# EAGLE schematic RelTerHig (EAGLE 6.3)
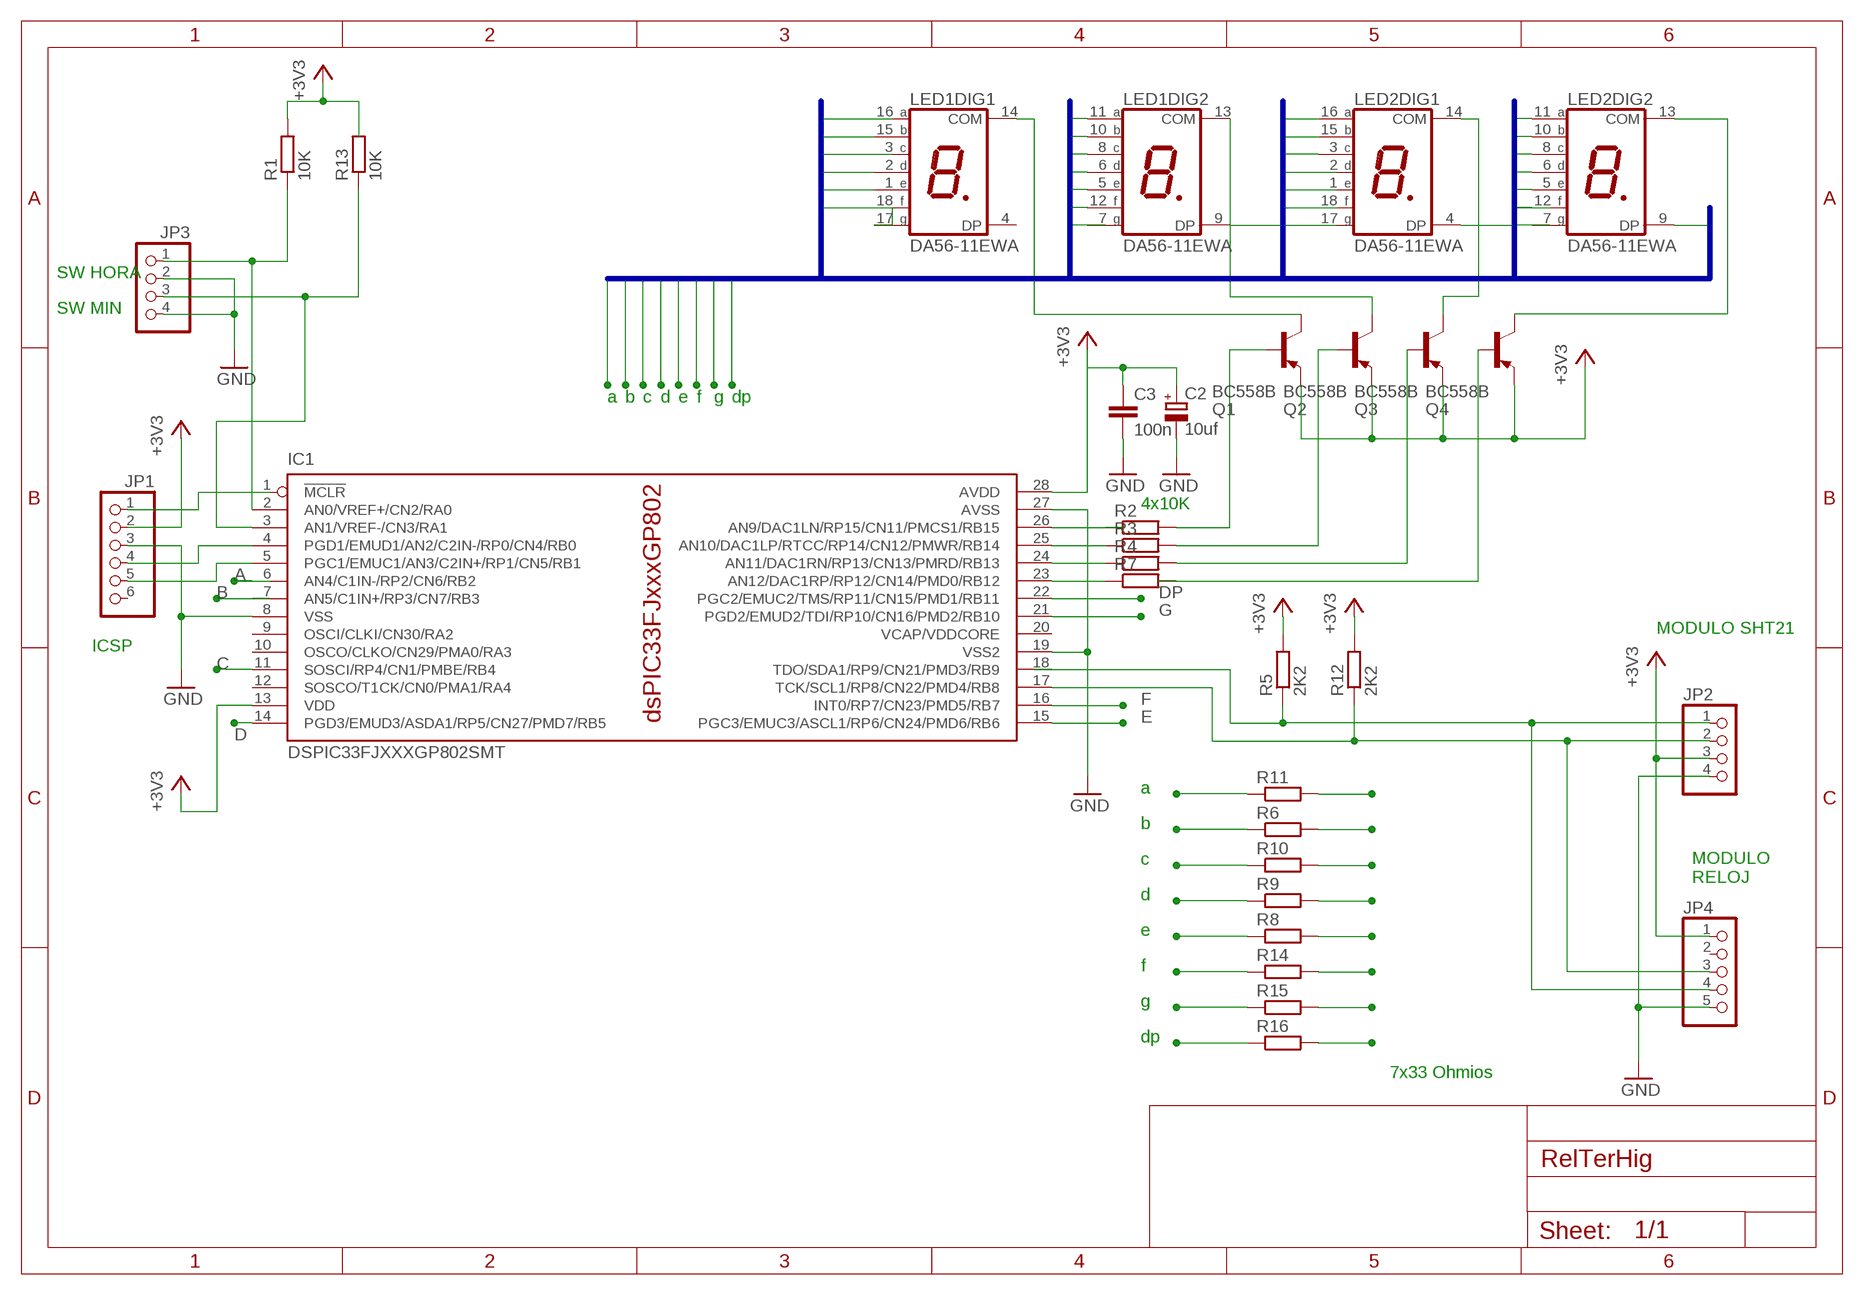
[diagram p0: schematic, sheet 1]

## Parts
C2  10uf  CPOL-EUB/3528-21R  [B/3528-21R]
C3  100n  C-EU025-024X044  [C025-024X044]
IC1  DSPIC33FJXXXGP802SMT  [SO28W]
JP1  PINHD-1X6  [1X06]
JP2  PINHD-1X4  [1X04]
JP3  PINHD-1X4  [1X04]
JP4  PINHD-1X5  [1X05]
LED1  DA56-11EWA  [DA56]
LED2  DA56-11EWA  [DA56]
Q1  BC558B  [TO92-EBC]
Q2  BC558B  [TO92-EBC]
Q3  BC558B  [TO92-EBC]
Q4  BC558B  [TO92-EBC]
R1  10K  R-EU_0204/5  [0204/5]
R2  R-EU_0204/5  [0204/5]
R3  R-EU_0204/5  [0204/5]
R4  R-EU_0204/5  [0204/5]
R5  2K2  R-EU_0204/5  [0204/5]
R6  R-EU_0204/5  [0204/5]
R7  R-EU_0204/5  [0204/5]
R8  R-EU_0204/5  [0204/5]
R9  R-EU_0204/5  [0204/5]
R10  R-EU_0204/5  [0204/5]
R11  R-EU_0204/5  [0204/5]
R12  2K2  R-EU_0204/5  [0204/5]
R13  10K  R-EU_0204/5  [0204/5]
R14  R-EU_0204/5  [0204/5]
R15  R-EU_0204/5  [0204/5]
R16  R-EU_0204/5  [0204/5]

## Nets
+3V3: C2.+ C3.1 IC1.13(VDD) IC1.28(AVDD) JP1.2 JP2.3 JP4.1 Q1.E Q2.E Q3.E Q4.E R1.2 R5.2 R12.2 R13.2
A: IC1.6(AN4/C1IN-/RP2/CN6/RB2)
B$1: LED1.1(DIG1:E) LED1.2(DIG1:D) LED1.5(DIG2:E) LED1.6(DIG2:D) LED1.8(DIG2:C) LED1.9(DIG2:DP) LED1.10(DIG2:B) LED1.11(DIG2:A) LED1.12(DIG2:F) LED1.15(DIG1:B) LED1.17(DIG1:G) LED2.4(DIG1:DP) LED2.5(DIG2:E) LED2.6(DIG2:D) LED2.8(DIG2:C) LED2.9(DIG2:DP) LED2.10(DIG2:B) LED2.11(DIG2:A) LED2.12(DIG2:F) LED2.15(DIG1:B) LED2.16(DIG1:A)
C: IC1.11(SOSCI/RP4/CN1/PMBE/RB4)
D: IC1.14(PGD3/EMUD3/ASDA1/RP5/CN27/PMD7/RB5)
DP: IC1.22(PGC2/EMUC2/TMS/RP11/CN15/PMD1/RB11)
E: IC1.15(PGC3/EMUC3/ASCL1/RP6/CN24/PMD6/RB6)
F: IC1.16(INT0/RP7/CN23/PMD5/RB7)
G: IC1.21(PGD2/EMUD2/TDI/RP10/CN16/PMD2/RB10)
GND: C2.- C3.2 IC1.8(VSS) IC1.19(VSS2) IC1.27(AVSS) JP1.3 JP2.4 JP3.2 JP3.4 JP4.5
N$1: IC1.26(AN9/DAC1LN/RP15/CN11/PMCS1/RB15)
N$2: IC1.25(AN10/DAC1LP/RTCC/RP14/CN12/PMWR/RB14) R3.1
N$3: IC1.24(AN11/DAC1RN/RP13/CN13/PMRD/RB13) R4.1
N$4: IC1.23(AN12/DAC1RP/RP12/CN14/PMD0/RB12) R7.1
N$5: Q1.B R2.2
N$6: Q2.B R3.2
N$7: Q3.B R4.2
N$8: Q4.B R7.2
N$9: IC1.1(!MCLR) JP1.1
N$10: LED1.14(DIG1:COM) Q1.C
N$11: IC1.4(PGD1/EMUD1/AN2/C2IN-/RP0/CN4/RB0) JP1.4
N$12: IC1.5(PGC1/EMUC1/AN3/C2IN+/RP1/CN5/RB1) JP1.5
N$13: IC1.2(AN0/VREF+/CN2/RA0) JP3.1 R1.1
N$14: IC1.3(AN1/VREF-/CN3/RA1) JP3.3 R13.1
N$15: JP2.1 JP4.4 R5.1
N$16: IC1.17(TCK/SCL1/RP8/CN22/PMD4/RB8) JP2.2 JP4.3 R12.1
N$17: LED1.13(DIG2:COM) Q2.C
N$18: LED2.14(DIG1:COM) Q3.C
N$19: R11.2
N$20: LED2.13(DIG2:COM) Q4.C
N$21: R6.2
N$22: R10.2
N$23: R9.2
N$24: R8.2
N$25: R14.2
N$26: R15.2
N$27: R11.1
N$28: R6.1
N$29: R10.1
N$30: R9.1
N$31: R8.1
N$32: R14.1
N$33: R15.1
N$34: R16.1
N$35: R16.2
Unconnected: IC1.7(AN5/C1IN+/RP3/CN7/RB3) IC1.9(OSCI/CLKI/CN30/RA2) IC1.10(OSCO/CLKO/CN29/PMA0/RA3) IC1.12(SOSCO/T1CK/CN0/PMA1/RA4) IC1.18(TDO/SDA1/RP9/CN21/PMD3/RB9) JP1.6 JP4.2 LED1.3(DIG1:C) LED1.4(DIG1:DP) LED1.7(DIG2:G) LED1.16(DIG1:A) LED1.18(DIG1:F) LED2.1(DIG1:E) LED2.2(DIG1:D) LED2.3(DIG1:C) LED2.7(DIG2:G) LED2.17(DIG1:G) LED2.18(DIG1:F) R2.1

## Buses
B$1

## Notes on the sheet
- SW HORA
- SW MIN
- a | b | c | d | e | f | g | dp
- 4x10K
- MODULO SHT21
- ICSP
- a
- b
- c
- MODULO
  RELOJ
- d
- e
- f
- g
- dp
- 7x33 Ohmios

## Power pins joined to a net without a drawn wire
VCAP/VDDCORE: IC1.20(VCAP/VDDCORE)

## Library data of the parts
C2 = rcl:CPOL-EU: POLARIZED CAPACITOR, European symbol
C3 = rcl:C-EU: CAPACITOR, European symbol
IC1 = microchip-dspic33:DSPIC33FJXXXGP802: High-Performance, 16-bit Digital Signal Controllers - dsPIC33FJ64GP802 & dsPIC33FJ128GP802 Source: http://ww1.microchip.com/downloads/en/DeviceDoc/70292B.pdf Operating Range: . Up to 40 MIPS operation (at 3.0-3.6V): - Industrial temperature range (-40°C to +85°C) - Extended temperature range (-40°C to +125°C) High-Performance DSC CPU: . Modified Harvard architecture . C compiler optimized instruction set . 16-bit wide data path . 24-bit wide instructions . Linear program memory addressing up to 4M instruction words . Linear data memory addressing up to 64 Kbytes . 83 base instructions: mostly 1 word/1 cycle . Two 40-bit accumulators with rounding and saturation options . Flexible and powerful addressing modes: - Indirect - Modulo - Bit-Reversed . Software stack . 16 x 16 fractional/integer multiply operations . 32/16 and 16/16 divide operations . Single-cycle multiply and accumulate: - Accumulator write back for DSP operations - Dual data fetch . Up to ±16-bit shifts for up to 40-bit data On-Chip Flash and SRAM: . Flash program memory . Data SRAM . Boot, Secure, and General Security for program Flash Direct Memory Access (DMA): . 8-channel hardware DMA . Up to 2 Kbytes dual ported DMA buffer area (DMA RAM) to store data transferred via DMA: - Allows data transfer between RAM and a peripheral while CPU is executing code (no cycle stealing) . Most peripherals support DMA Timers/Capture/Compare/PWM: . Timer/Counters, up to five 16-bit timers: - Can pair up to make two 32-bit timers - One timer runs as a Real-Time Clock with an external 32.768 kHz oscillator - Programmable prescaler . Input Capture (up to four channels): - Capture on up, down or both edges - 16-bit capture input functions - 4-deep FIFO on each capture . Output Compare (up to four channels): - Single or Dual 16-bit Compare mode - 16-bit Glitchless PWM mode . Hardware Real-Time Clock/Calendar (RTCC): - Provides clock, calendar, and alarm functions Interrupt Controller: . 5-cycle latency . 118 interrupt vectors . Up to 49 available interrupt sources . Up to three external interrupts . Seven programmable priority levels . Five processor exceptions Digital I/O: . Peripheral pin Select functionality . Up to 35 programmable digital I/O pins . Wake-up/Interrupt-on-Change for up to 21 pins . Output pins can drive from 3.0V to 3.6V . Up to 5V output with open drain configuration . All digital input pins are 5V tolerant . 4 mA sink on all I/O pins System Management: . Flexible clock options: - External, crystal, resonator, internal RC - Fully integrated Phase-Locked Loop (PLL) - Extremely low jitter PLL . Power-up Timer . Oscillator Start-up Timer/Stabilizer . Watchdog Timer with its own RC oscillator . Fail-Safe Clock Monitor . Reset by multiple sources Power Management: . On-chip 2.5V voltage regulator . Switch between clock sources in real time . Idle, Sleep, and Doze modes with fast wake-up Analog-to-Digital Converters (ADCs): . 10-bit, 1.1 Msps or 12-bit, 500 Ksps conversion: - Two and four simultaneous samples (10-bit ADC) - Up to 13 input channels with auto-scanning - Conversion start can be manual or synchronized with one of four trigger sources - Conversion possible in Sleep mode - ±2 LSb max integral nonlinearity - ±1 LSb max differential nonlinearity Audio Digital-to-Analog Converter (DAC): . 16-bit Dual Channel DAC module . 100 Ksps maximum sampling rate . Second-Order Digital Delta-Sigma Modulator Data Converter Interface (DCI) module: . Codec interface . Supports I2S and AC.97 protocols . Up to 16-bit data words, up to 16 words per frame . 4-word deep TX and RX buffers Comparator Module: . Two analog comparators with programmable input/output configuration CMOS Flash Technology: . Low-power, high-speed Flash technology . Fully static design . 3.3V (±10%) operating voltage . Industrial and Extended temperature . Low power consumption Communication Modules: . 4-wire SPI (up to two modules): - Framing supports I/O interface to simple codecs - Supports 8-bit and 16-bit data - Supports all serial clock formats and sampling modes . I2C?: - Full Multi-Master Slave mode support - 7-bit and 10-bit addressing - Bus collision detection and arbitration - Integrated signal conditioning - Slave address masking . UART (up to two modules): - Interrupt on address bit detect - Interrupt on UART error - Wake-up on Start bit from Sleep mode - 4-character TX and RX FIFO buffers - LIN bus support - IrDA® encoding and decoding in hardware - High-Speed Baud mode - Hardware Flow Control with CTS and RTS . Enhanced CAN (ECAN. module) 2.0B active: - Up to eight transmit and up to 32 receive buffers - 16 receive filters and three masks - Loopback, Listen Only and Listen All - Messages modes for diagnostics and bus monitoring - Wake-up on CAN message - Automatic processing of Remote Transmission Requests - FIFO mode using DMA - DeviceNet. addressing support . Parallel Master Slave Port (PMP/EPSP): - Supports 8-bit or 16-bit data - Supports 16 address lines . Programmable Cyclic Redundancy Check (CRC): - Programmable bit length for the CRC generator polynomial (up to 16-bit length) - 8-deep, 16-bit or 16-deep, 8-bit FIFO for data input
JP1 = pinhead:PINHD-1X6: PIN HEADER
JP2 JP3 = pinhead:PINHD-1X4: PIN HEADER
JP4 = pinhead:PINHD-1X5: PIN HEADER
LED1 LED2 = display-kingbright:DA56-11: 14.22mm (0.56INCH) DUAL DIGIT NUMERIC DISPLAYS Source: www.kingbright.com .. DA56-11SRWA.pdf; OC_FARNELL: unknown; OC_NEWARK: unknown
Q1-Q4 = transistor-pnp:BC558*: PNP Transistror
R1-R16 = resistor:R-EU_: RESISTOR, European symbol